# Altium schematic sheet AFE.SchDoc
size B; Organization: Altium Limited; Address1: L3, 12a Rodborough Rd; Address2: Frenchs Forest; Address3: NSW; Address4: Australia 2086
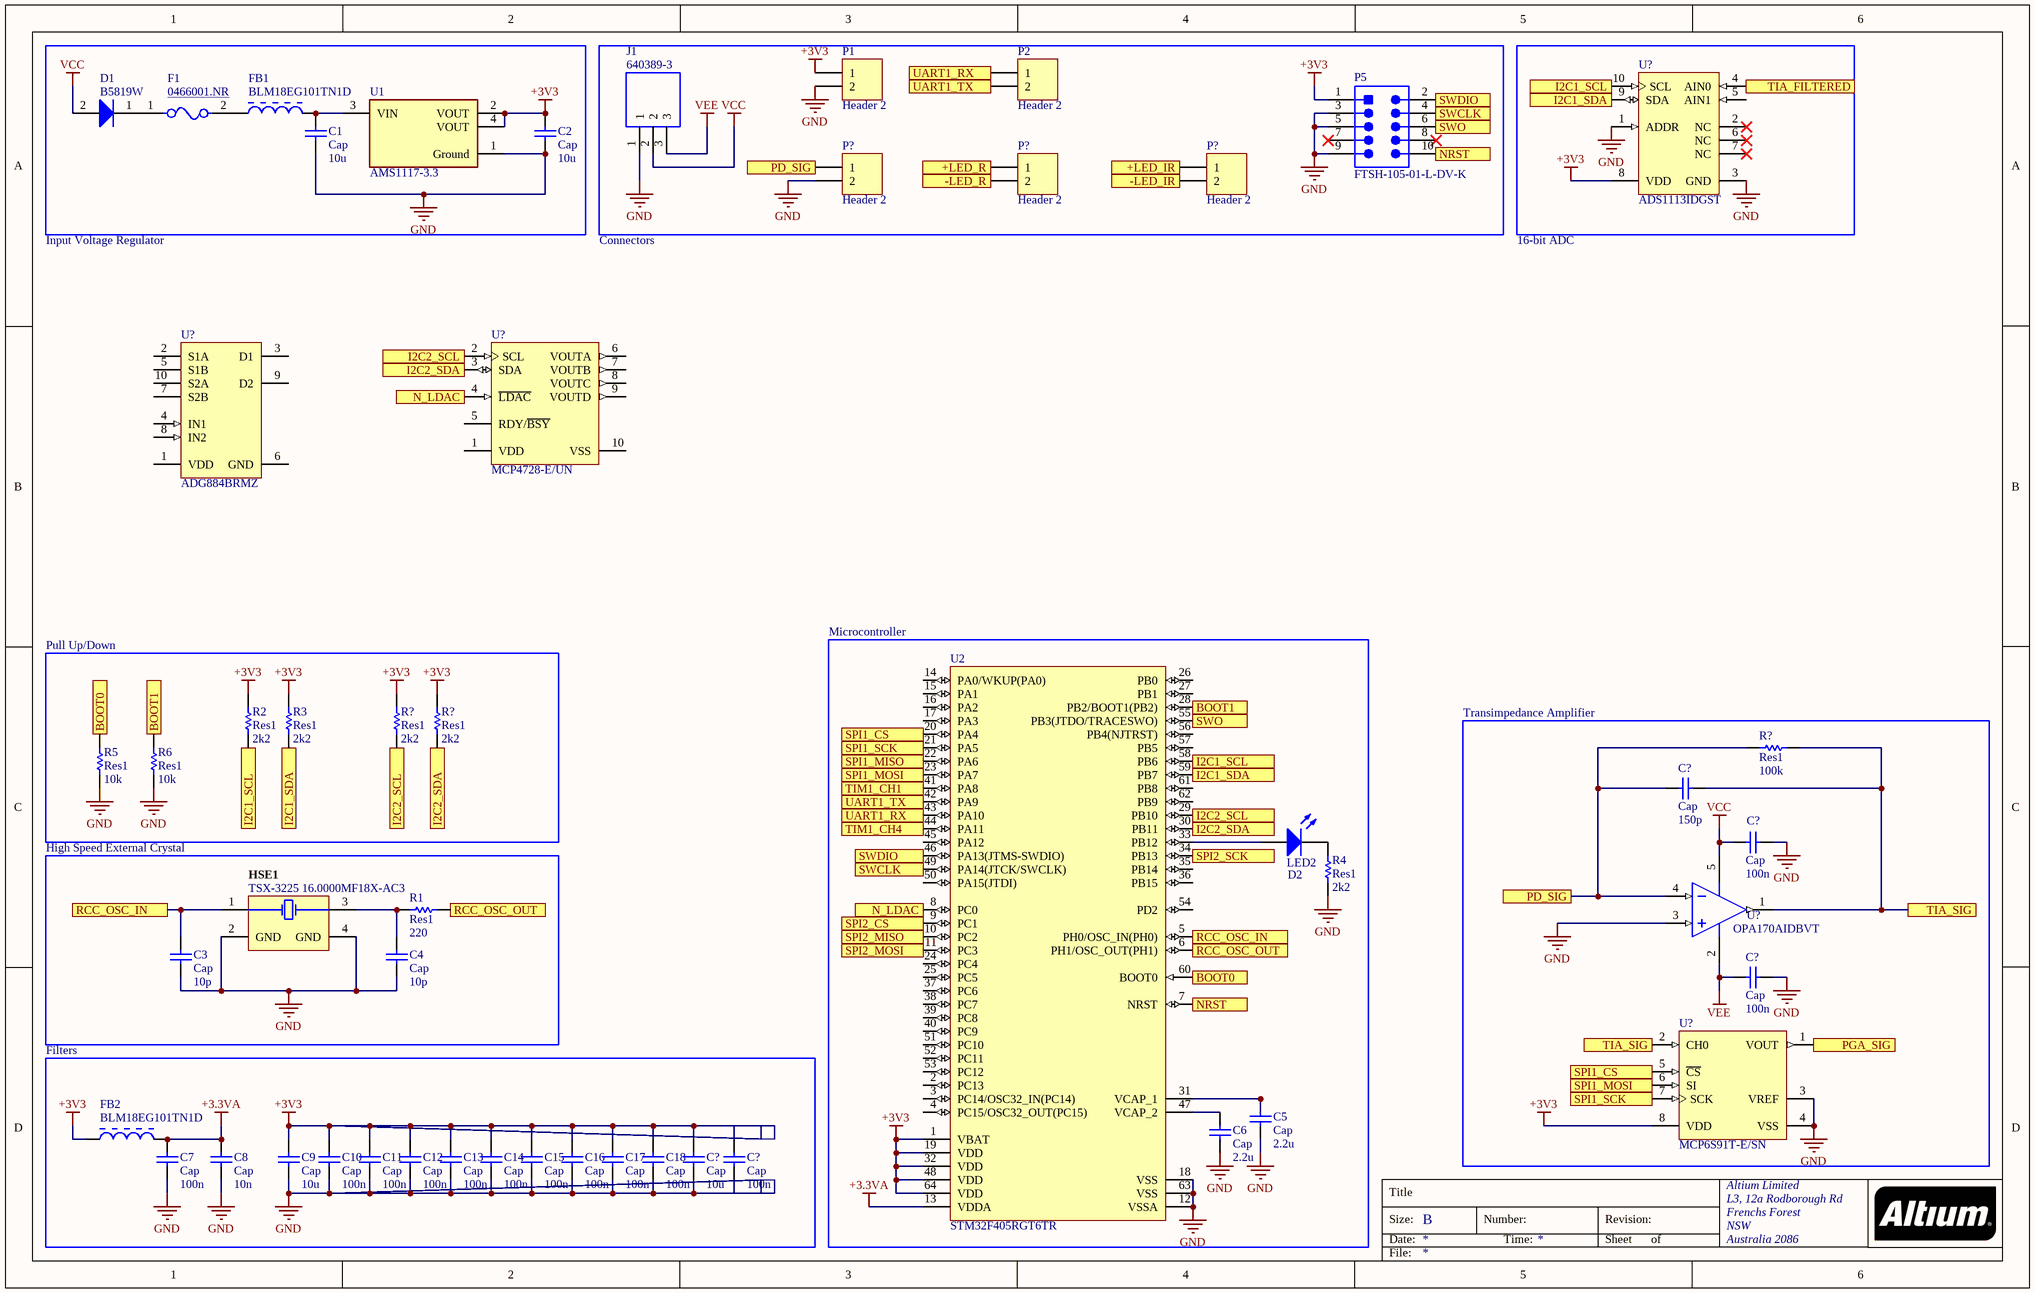
[diagram p0: AFE.SchDoc]

## Parts
(Parts that share a designator on the sheet are numbered #1, #2 ... from top to bottom, then left to right.)
C1  Cap  value 10u  [RAD-0.3]
C2  Cap  value 10u  [RAD-0.3]
C3  Cap  value 10p  [RAD-0.3]
C4  Cap  value 10p  [RAD-0.3]
C5  Cap  value 2.2u  [RAD-0.3]
C6  Cap  value 2.2u  [RAD-0.3]
C7  Cap  value 100n  [RAD-0.3]
C8  Cap  value 10n  [RAD-0.3]
C9  Cap  value 10u  [RAD-0.3]
C10  Cap  value 100n  [RAD-0.3]
C11  Cap  value 100n  [RAD-0.3]
C12  Cap  value 100n  [RAD-0.3]
C13  Cap  value 100n  [RAD-0.3]
C14  Cap  value 100n  [RAD-0.3]
C15  Cap  value 100n  [RAD-0.3]
C16  Cap  value 100n  [RAD-0.3]
C17  Cap  value 100n  [RAD-0.3]
C18  Cap  value 100n  [RAD-0.3]
C?#1  Cap  value 150p  [RAD-0.3]
C?#2  Cap  value 100n  [RAD-0.3]
C?#3  Cap  value 100n  [RAD-0.3]
C?#4  Cap  value 10u  [RAD-0.3]
C?#5  Cap  value 100n  [RAD-0.3]
D1  B5819W  [ONSC-SOD-323-2-477-02_V]
D2  LED2  [3.2X1.6X1.1]
F1  0466001.NR  [FP-0466-MFG]
FB1  BLM18EG101TN1D  [MURA-BLM18-RF-H3-CHIP-2_V]
FB2  BLM18EG101TN1D  [MURA-BLM18-RF-H3-CHIP-2_V]
HSE1  TSX-3225 16.0000MF18X-AC3  [EPSON-TSX-3225_V]
J1  640389-3  [640389-3]
P1  Header 2  [HDR1X2]
P2  Header 2  [HDR1X2]
P5  FTSH-105-01-L-DV-K  [SMTC-FTSH-105-01-L-DV-K_V]
P?#1  Header 2  [HDR1X2]
P?#2  Header 2  [HDR1X2]
P?#3  Header 2  [HDR1X2]
R1  Res1  value 220  [AXIAL-0.3]
R2  Res1  value 2k2  [AXIAL-0.3]
R3  Res1  value 2k2  [AXIAL-0.3]
R4  Res1  value 2k2  [AXIAL-0.3]
R5  Res1  value 10k  [AXIAL-0.3]
R6  Res1  value 10k  [AXIAL-0.3]
R?#1  Res1  value 2k2  [AXIAL-0.3]
R?#2  Res1  value 2k2  [AXIAL-0.3]
R?#3  Res1  value 100k  [AXIAL-0.3]
U1  AMS1117-3.3  [FP-AMS1117-IPC_C]
U2  STM32F405RGT6TR  [STM-LQFP64_L]
U?#1  ADS1113IDGST  [TI-DGS10_L]
U?#2  ADG884BRMZ  [ADI-RM-10_L]
U?#3  MCP4728-E/UN  [MSOP-UN10_N]
U?#4  OPA170AIDBVT  [DBV0005A_L]
U?#5  MCP6S91T-E/SN  [SOIC-SN8_N]

## Blocks framed on the sheet
Pull Up/Down: R2 R3 R5 R6 R?#1 R?#2
Microcontroller: C5 C6 D2 R4 U2
Transimpedance Amplifier: C?#1-C?#3 R?#3 U?#4 U?#5
High Speed External Crystal: C3 C4 HSE1 R1
Filters: C7-C18 C?#4 C?#5 FB2

## Ports
+LED_IR, +LED_R, -LED_IR, -LED_R, BOOT0, BOOT1, I2C1_SCL, I2C1_SDA, I2C2_SCL, I2C2_SDA, N_LDAC, NRST, PD_SIG, PGA_SIG, RCC_OSC_IN, RCC_OSC_OUT, SPI1_CS, SPI1_MISO, SPI1_MOSI, SPI1_SCK, SPI2_CS, SPI2_MISO, SPI2_MOSI, SPI2_SCK, SWCLK, SWDIO, SWO, TIA_FILTERED, TIA_SIG, TIM1_CH1, TIM1_CH4, UART1_RX, UART1_TX

## Nets
+3.3VA: C7.2 C8.2 FB2.2 U2.13(VDDA)
+3V3: C2.2 C9.2 C10.2 C11.2 C12.2 C13.2 C14.2 C15.2 C16.2 C17.2 C18.2 C?#4.2 C?#5.2 FB2.1 P1.1 P5.1 R2.2 R3.2 R?#1.2 R?#2.2 U1.2(VOUT) U1.4(VOUT) U2.1(VBAT) U2.19(VDD) U2.32(VDD) U2.48(VDD) U2.64(VDD) U?#1.8(VDD) U?#5.8(VDD)
GND: C1.1 C2.1 C3.1 C4.1 C5.1 C6.1 C7.1 C8.1 C9.1 C10.1 C11.1 C12.1 C13.1 C14.1 C15.1 C16.1 C17.1 C18.1 C?#2.1 C?#3.1 C?#4.1 C?#5.1 HSE1.2(GND) HSE1.4(GND) J1.1 P1.2 P5.3 P5.5 P5.9 P?#1.2 R4.1 R5.1 R6.1 U1.1(Ground) U2.12(VSSA) U2.18(VSS) U2.63(VSS) U?#1.1(ADDR) U?#1.3(GND) U?#4.3(IN+) U?#5.3(VREF) U?#5.4(VSS)
VCC: C?#2.2 D1.2(A) J1.2 U?#4.5(V+)
VEE: C?#3.2 J1.3 U?#4.2(V-)
+LED_IR: P?#3.1 ; port +LED_IR
+LED_R: P?#2.1 ; port +LED_R
-LED_IR: P?#3.2 ; port -LED_IR
-LED_R: P?#2.2 ; port -LED_R
BOOT0: R5.2 U2.60(BOOT0) ; port BOOT0
BOOT1: R6.2 U2.28(PB2/BOOT1(PB2)) ; port BOOT1
I2C1_SCL: R2.1 U2.58(PB6) U?#1.10(SCL) ; port I2C1_SCL
I2C1_SDA: R3.1 U2.59(PB7) U?#1.9(SDA) ; port I2C1_SDA
I2C2_SCL: R?#1.1 U2.29(PB10) U?#3.2(SCL) ; port I2C2_SCL
I2C2_SDA: R?#2.1 U2.30(PB11) U?#3.3(SDA) ; port I2C2_SDA
N_LDAC: U2.8(PC0) U?#3.4(~{LDAC}) ; port N_LDAC
NRST: P5.10 U2.7(NRST) ; port NRST
PD_SIG: C?#1.2 P?#1.1 R?#3.2 U?#4.4(IN-) ; port PD_SIG
PGA_SIG: U?#5.1(VOUT) ; port PGA_SIG
RCC_OSC_IN: C3.2 HSE1.1(X1) U2.5(PH0/OSC_IN(PH0)) ; port RCC_OSC_IN
RCC_OSC_OUT: R1.2 U2.6(PH1/OSC_OUT(PH1)) ; port RCC_OSC_OUT
SPI1_CS: U2.20(PA4) U?#5.5(~{CS}) ; port SPI1_CS
SPI1_MISO: U2.22(PA6) ; port SPI1_MISO
SPI1_MOSI: U2.23(PA7) U?#5.6(SI) ; port SPI1_MOSI
SPI1_SCK: U2.21(PA5) U?#5.7(SCK) ; port SPI1_SCK
SPI2_CS: U2.9(PC1) ; port SPI2_CS
SPI2_MISO: U2.10(PC2) ; port SPI2_MISO
SPI2_MOSI: U2.11(PC3) ; port SPI2_MOSI
SPI2_SCK: U2.34(PB13) ; port SPI2_SCK
SWCLK: P5.4 U2.49(PA14(JTCK/SWCLK)) ; port SWCLK
SWDIO: P5.2 U2.46(PA13(JTMS-SWDIO)) ; port SWDIO
SWO: P5.6 U2.55(PB3(JTDO/TRACESWO)) ; port SWO
TIA_FILTERED: U?#1.4(AIN0) ; port TIA_FILTERED
TIA_SIG: C?#1.1 R?#3.1 U?#4.1(OUT) U?#5.2(CH0) ; port TIA_SIG
TIM1_CH1: U2.41(PA8) ; port TIM1_CH1
TIM1_CH4: U2.44(PA11) ; port TIM1_CH4
UART1_RX: P2.1 U2.43(PA10) ; port UART1_RX
UART1_TX: P2.2 U2.42(PA9) ; port UART1_TX
NetC1_2: C1.2 FB1.2 U1.3(VIN)
NetC4_2: C4.2 HSE1.3(X2) R1.1
NetC5_2: C5.2 U2.31(VCAP_1)
NetC6_2: C6.2 U2.47(VCAP_2)
NetD1_1: D1.1(K) F1.1
NetD2_1: D2.1(A) U2.33(PB12)
NetD2_2: D2.2(K) R4.2
NetF1_2: F1.2 FB1.1

Not connected (* = marked no-connect by the designer): P5 7* 8*; U2 2(PC13) 3(PC14/OSC32_IN(PC14)) 4(PC15/OSC32_OUT(PC15)) 14(PA0/WKUP(PA0)) 15(PA1) 16(PA2) 17(PA3) 24(PC4) 25(PC5) 26(PB0) 27(PB1) 35(PB14) 36(PB15) 37(PC6) 38(PC7) 39(PC8) 40(PC9) 45(PA12) 50(PA15(JTDI)) 51(PC10) 52(PC11) 53(PC12) 54(PD2) 56(PB4(NJTRST)) 57(PB5) 61(PB8) 62(PB9); U?#1 2(NC)* 5(AIN1) 6(NC)* 7(NC)*; U?#2 1(VDD) 2(S1A) 3(D1) 4(IN1) 5(S1B) 6(GND) 7(S2B) 8(IN2) 9(D2) 10(S2A); U?#3 1(VDD) 5(RDY/~{BSY}) 6(VOUTA) 7(VOUTB) 8(VOUTC) 9(VOUTD) 10(VSS)

## Notes on the sheet
- Input Voltage Regulator
- Connectors
- 16-bit ADC
- Title
- Size:
- Date:
- B
- Number:
- Time:
- Revision:
- Sheet
- of
- File:

## Library data of the parts
C1-C18 C?#1-C?#5 = Cap: Capacitor; Published: 8-Jun-2000; LatestRevisionDate: 17-Jul-2002; LatestRevisionNote: Re-released for DXP Platform.; PackageReference: RAD-0.3; Publisher: Altium Limited; PackageDescription: Radial Cap, Thru-Hole; 2 Leads; 0.3 in Pin Spacing
D1 = CMP-1055-00462-1: Schottky Barrier Diode, 2-Pin SOD-323, Pb-Free, Tape and Reel; PartNumber: BAT54HT1G; Manufacturer: On Semiconductor; Configuration: Single; trr Max (ns): 5; IFSM Max (A): 0.6; ComponentLink3URL: http://www.onsemi.com/pub_link/Collateral/477-02.PDF.1; PackageDescription: 2-Pin SOD, Body 1.7 x 1.25 mm; ComponentLink2URL: http://www.onsemi.cn/pub_link/Collateral/BAT54HT1-D.PDF; ComponentLink3Description: Package Specification; ComponentLink2Description: Datasheet; DatasheetVersion: Rev. 6; PackageReference: SOD-323-2-477-02; RoHS: TRUE; ComponentLink1URL: http://www.onsemi.com/; Packing: Tape and Reel; Mounting Technology: Surface Mount; ComponentLink1Description: Manufacturer URL; PackageVersion: Rev. H, 03/2007
D2 = LED2: Typical RED, GREEN, YELLOW, AMBER GaAs LED; Published: 8-Jun-2000; LatestRevisionDate: 17-Jul-2002; LatestRevisionNote: Re-released for DXP Platform.; PackageVersion: Feb-2002; PackageReference: 3.2X1.6X1.1; Publisher: Altium Limited; PackageDescription: SM LED; 2 Flat Leads
F1 = CMP-08605-000058-1: FUSE BOARD MNT 1A 63VAC/VDC 1206; Manufacturer: Littelfuse Inc; Max Fuse Dc Voltage: 63V; Fuse Interrupt Ac Current: 50A; Fuse Voltage Drop: 79.97mV; Resistance: 0.075Ω; Value: 0.075Ω; Fuse I2T: 0.0423A2Sec; Fuse Blow Speed: Fast; Temperature Range High: +90°C; Max Fuse Ac Voltage: 63V; Manufacturer Part Number: 0466001.NR; Package: 0466; ComponentLink2URL: https://www.littelfuse.com/~/media/electronics/datasheets/fuses/littelfuse_fuse_466_datasheet.pdf.pdf; Device Class L3: unset; Lead Free: Yes; Automotive: No; Digikey Description: FUSE BOARD MNT 1A 63VAC/VDC 1206; Height: 0.66mm; Temperature Range Low: -55°C; Category: Fuse; ComponentLink2Description: Datasheet; Device Class L1: Circuit Protection; Device Class L2: Fuses; Fuse Current: 1A; Mouser Description: Surface Mount Fuses 63V FA 1206 1A VFA Slimline; Octopart: https://octopart.com/0466001.nr-littelfuse-566005; Fuse Interrupt Dc Current: 50A; RoHS: TRUE; Voltage Rating: 63V; Temperature: -55°C to +90°C
FB1 FB2 = CMP-0686-00530-2: Chip Ferrite Bead for GHz Band General Use (Low DC Resistance Type), 100 Ohm, 2000 mA, -55 to 125 degC, 1.6 x 0.8 x 0.65 mm SMD, Tape and Reel; Manufacturer: Murata; Rated Current: 2000 mA; Impedance (at 100 MHz): 100 Ohm +/- 25%; DC Resistance: 0.045 Ohm Max.; ComponentLink3Description: Package Specification; ComponentLink2URL: http://www.murata.com/products/catalog/pdf/c31e.pdf; DatasheetVersion: 08/2013; ComponentLink1Description: Manufacturer URL; Packing: Tape and Reel; PackageDescription: 2-Pin Chip, Body 1.6 x 0.8 mm; Operating Temperature Range: -55 to 125 degC; ComponentLink1URL: http://www.murata.com/; ComponentLink2Description: Datasheet; Mounting Technology: Surface Mount; PartNumber: BLM18EG101TN1D; ComponentLink3URL: http://www.murata.com/products/catalog/pdf/c31e.pdf; PackageReference: BLM18_H650-2
HSE1 = CMP-2000-07332-1: MHz Range Crystal Unit, 16 MHz, -40 to 85 degC, 4-Pin SMD, RoHS, Tape and Reel; Manufacturer: Epson; Unit Weight: 0.000564oz; Tolerance: 10PPM; ESR: 60Ohms; Frequency: 16MHz; Drive Level: 200uW; Brand: EpsonTiming; Load Capacitance: 9pF; Product Category: Crystals; Packaging: Reel; Termination Style: SMD/SMT; Width: 2.5mm; Length: 3.2mm; Type: Crystal; Datasheet Version: 12/2015; Factory Pack Quantity: 250; Package Description: 4-Pin Surface Mount Device, Body 3.2 x 2.5 mm; Package / Case: 3.2mmx2.5mm; Mounting Style: SMD/SMT; Series: TSX-3225; Frequency Stability: 10PPM; Package Reference: TSX-3225; Mounting Technology: SurfaceMount; RoHS: True; Height: 0.6mm; Datasheet URL: https://support.epson.biz/td/api/doc_check.php?dl=brief_FA-238V_en.pdf; Operating Temperature Range: -40Cto+85C; Manufacturer URL: https://www.eea.epson.com/
J1 = 640389-3: 3 way r/a friction lock header,3.96mm TE Connectivity MTA-156 Series, 3.96mm Pitch 3 Way 1 Row Right Angle PCB Header, Solder Termination, 7A; Allied_Number: 70083704; Manufacturer_Name: TE Connectivity; Manufacturer_Part_Number: 640389-3; Mouser Part Number: 571-6403893; Mouser Price/Stock: https://www.mouser.com/Search/Refine.aspx?Keyword=571-6403893; RS Part Number: 5355894P; RS Price/Stock: http://uk.rs-online.com/web/p/products/5355894P; Allied Price/Stock: http://www.alliedelec.com/te-connectivity-640389-3/70083704/; Datasheet Link: http://docs-emea.rs-online.com/webdocs/06b6/0900766b806b63a3.pdf
P1 P2 P?#1-P?#3 = Header 2: Header, 2-Pin; LatestRevisionDate: 17-Jul-2002; LatestRevisionNote: Re-released for DXP Platform.; Publisher: Altium Limited
P5 = CMP-2000-05353-1: Male Header, Pitch 1.27 mm, 2 x 5 Position, Height 6.25 mm; Manufacturer: Samtec; Pitch: 0.050"(1.27mm); Other Names: Q3937619; Number of Positions: 10; Mating Products: SFMC-105-L2-S-D-TR-ND / -CONN.05"SURFACE10POSSMT / FLE-105-01-G-DV-TR-ND / -CONNSKT1.27MM10POSDUALSMD / FLE-105-01-G-DV-A-P-ND / -CONNSKT1.27MM10POSDUALSMD / FLE-105-01-G-DV-A-ND / -CONNSKT1.27MM10POSDUALSMD / CLP-105-02-G-D-P-TR-ND / -CONNRCPT10POSDUAL.05"SMD / SAM1155-05-ND / -CONNRCPT10POSDUAL.05"SMD / SAM1154-05-ND / -CONNRCPT10POSDUAL.05"SMD / SAM1153-05-ND / -CONNRCPT10POSDUAL.05"SMD / SAM1226-05-ND / -CONNRCPT.05"10POSDUALSMD; Number of Positions Loaded: All; Connector Type: Header,Unshrouded; Product Training Modules: Board-to-BoardConnectors; Datasheet Version: Rev. ET, 10/1995; Number of Rows: 2; Standard Package: 1; Package Description: Male Header, Pitch 1.27 mm, 2 x 5 Position, Height 5.97 mm, Tail Length 4.32 mm; Contact Finish Thickness: 10µin(0.25µm); Series: FTSH; Termination: Solder; Contact Type: MalePin; Color: Black; Package Reference: FTSH-105-01-L-DV-K; Family: RectangularConnectors-Headers,MalePins; Package URL: http://suddendocs.samtec.com/prints/ftsh-1xx-xx-xxx-dv-xxx-footprint.pdf; Packaging: Tube; Mounting Type: SurfaceMount; Category: Connectors,Interconnects; Datasheet URL: http://suddendocs.samtec.com/prints/ftsh-1xx-xx-xxx-dv-xxx-mkt.pdf; Row Spacing: 0.050"(1.27mm); Manufacturer URL: http://www.samtec.com/; Contact Mating Length: 0.120"(3.05mm); Contact Finish: Gold
R1-R6 R?#1-R?#3 = Res1: Resistor; Published: 8-Jun-2000; LatestRevisionDate: 17-Jul-2002; LatestRevisionNote: Re-released for DXP Platform.; PackageReference: AXIAL-0.3; Publisher: Altium Limited; PackageDescription: Axial Device, Thru-Hole; 2 Leads; 0.3 in Pin Spacing
U1 = CMP-209535-000001-1: LDO Voltage Regulators 1A, 3.3V; Manufacturer: Advanced Monolithic Systems; Dropout Voltage: 1.1V; Output Type: Fixed; Nominal Supply Current: 5mA; Max Power Dissipation: 1.2W; Max Supply Voltage: 15V; Number Of Outputs: 1; Standoff Height: 0.64mm; Max Junction Temp: +125°C; Height: 1.8mm; Package: AMS1117; Device Class L2: Power Management ICs; ComponentLink2Description: Datasheet; ComponentLink2URL: http://www.advanced-monolithic.com/pdf/ds1117.pdf; Category: IC; RoHS: TRUE; Automotive: No; Device Class L1: Integrated Circuits (ICs); Output Current: 1A; Device Class L3: Voltage Regulators - Linear; Temperature: -40°C to +125°C; Output Voltage: 3.3V; Manufacturer Part Number: AMS1117-3.3; Temperature Range Low: -40°C; Octopart: https://octopart.com/ams1117-3.3-advanced+monolithic+systems-25899300; Lead Free: Yes; Ipc Land Pattern Name: SOT229P700X180-4; Temperature Range High: +125°C
U2 = CMP-0243-00156-1: ARM Cortex-M4 32-bit MCU+FPU, 1024 KB Flash, 192 KB Internal RAM, 51 I/Os, 64-Pin LQFP, -40 to 85 degC, Tape and Reel; Internal RAM Size (kB): 192; FLASH Size (Prog) (kB): 1024; Supply Voltage(Vcc) min (V): 1.8; D/A Converter: 2; Operating Frequency(F) (Processor speed) (MHz): 168; I/Os (High Current): 51; DatasheetVersion: Rev. 6; Package Description: LQFP64; ComponentLink2Description: Datasheet; ComponentLink1Description: Manufacturer URL; Packing: Tape and Reel; Mounting Technology: Surface Mount; Package Reference: 64-Pin Low-profile Quad Flat Package, Body 10 x 10 mm, Pitch 0.5 mm; ComponentLink2URL: http://www.st.com/st-web-ui/static/active/en/resource/technical/document/datasheet/DM00037051.pdf; ComponentLink1URL: http://www.st.com/; Core: ARM Cortex-M4
U?#1 = CMP-0003-00386-2: 16-Bit ADC with Integrated Multiplexer, Oscillator, and Reference, -40 to 125 degC, 10-pin SOP (DGS10), Green (RoHS & no Sb/Br); Manufacturer: Texas Instruments; Resolution(Bits): 16; INL(Max)(+/-LSB): 1; Interface: Serial I2C; Analog Voltage AV/DD(Max)(V): 5.5; Analog Voltage AV/DD(Min)(V): 2; SubFamily: Precision ADC (<=10MSPS); Architecture: Delta-Sigma; Sample Rate (max)(SPS): 860; ComponentLink2URL: http://www.ti.com/general/docs/lit/getliterature.tsp?genericPartNumber=ADS1113&fileType=pdf; Mounting Technology: Surface Mount; ComponentLink3Description: Package Specification; PartNumber: ADS1113IDGST; PackageDescription: 10-Pin Plastic Small Outline, Body 3 x 3 mm, Pitch 0.5 mm; ComponentLink1URL: http://www.ti.com/; PackageReference: DGS10; Eco-Plan: Green (RoHS & no Sb/Br); ComponentLink3URL: http://www.ti.com/lit/ml/mpds035b/mpds035b.pdf; PackageVersion: 4073272/C, 02/2004; Code_JEDEC: MO-153; ComponentLink2Description: Datasheet; # Input Channels: 1; ComponentLink1Description: Manufacturer URL; Digital Supply(Min)(V): 2; DatasheetVersion: SBAS444B; Digital Supply(Max)(V): 5.5
U?#2 = CMP-0790-00116-1: 0.5 Ohm CMOS, Dual 2:1 MUX / SPDT Audio Switches, -40 to 85 degC, 10-pin SOP (RM-10), Tube; Manufacturer: Analog Devices; Max Pos Supply: 5.5V; Is OFF: 200pA, 200pA, 200pA; Min Pos Supply: 1.8V; Ron (ohms): 0.5; Power Dissipation: 5.5uW; # Sw Functions: 2; ComponentLink2URL: http://www.analog.com/static/imported-files/data_sheets/ADG884.pdf; Packing: Tube; PackageDescription: 10-Pin Mini Small Outline Package, Body 3 x 3 mm, Pitch 0.5 mm; ComponentLink3URL: http://www.analog.com/static/imported-files/packages/PKG_PDF/MSOP%28RM%29/RM_10.pdf; ComponentLink3Description: Package Specification; PackageVersion: Aug-05; DatasheetVersion: Rev. D; PartNumber: ADG884BRMZ; Configuration: SPDT; Id, Is (ON): 200pA, 200pA, 200pA; ComponentLink2Description: Datasheet; ComponentLink1URL: http://www.analog.com/en/index.html; Code_JEDEC: MO-187-BA; Mounting Technology: Surface Mount; ComponentLink1Description: Manufacturer URL; PackageReference: RM-10
U?#3 = CMP-0188-01008-2: 12-Bit Quad Digital-to-Analog Converter with EEPROM Memory, 10-pin MSOP, Extended Temperature; ComponentLink2URL: http://ww1.microchip.com/downloads/en/DeviceDoc/22187E.pdf; ComponentLink3Description: Package Specification; PackageReference: MSOP-UN10; ComponentLink3URL: http://www.microchip.com/stellent/groups/techpub_sg/documents/packagingspec/en012702.pdf; ComponentLink2Description: Datasheet; PackageDescription: 10-Lead Plastic Micro Small Outline Package (UN) [MSOP]; DatasheetVersion: revE, Oct-2010; RevisionNote: URLs added. DatasheetVersion updated.; PackageVersion: revBB, Aug-2009; ComponentLink1Description: Manufacturer URL; ComponentLink1URL: http://www.microchip.com/
U?#4 = CMP-0272-00932-3: MicroPower, Rail-to-Rail Output, General Purpose Operational Amplifier, 2.7 to 36 V, -40 to 125 degC, 5-pin SOT23 (DBV5), Green (RoHS & no Sb/Br); Manufacturer: Texas Instruments; Total Supply Voltage(Min)(+5V is 5, +/-5V is 10): 2.7; Rating: Catalog; Vio (25C)(Max)(mV): 1.8; Packing: SMALL T&R; GBW(Typ)(MHz): 1.2; Sub Family: High Supply Voltage Amplifier (>=30V), Low Power Amp (<=500uA), Low Supply Voltage Amplifier (<=2.7V), Precision Amplifier; CMRR(Min)(dB): 104; Iq per channel(Max)(mA): 0.145; Number of Channels: 1; IIB(Max)(pA): 15; Offset Drift(Typ)(uV/C): 0.3; Total Supply Voltage(Max)(+5V is 5, +/-5V is 10): 36; Slew Rate(Typ)(V/us): 0.4; ComponentLink2Description: Datasheet; PackageReference: DBV0005A; ComponentLink1URL: http://www.ti.com/; DatasheetVersion: SBOS557B; ComponentLink1Description: Manufacturer URL; Mounting Technology: Surface Mount; ComponentLink3Description: Package Specification; ComponentLink3URL: http://www.ti.com/litv/pdf/mpds018i; PackageDescription: 5-Pin Plastic Small Outline, Body 1.6 x 2.9 mm, Pitch 0.95 mm; Eco-Plan: Green (RoHS & no Sb/Br); PackageVersion: 4073253-4/K, 03/2006; PartNumber: OPA170AIDBVT; ComponentLink2URL: http://www.ti.com/lit/ds/symlink/opa170.pdf; Code_JEDEC: MO-178
U?#5 = CMP-0187-00272-2: Single-Ended, Rail-to-Rail Input/Output, Low-Gain Programmable Gain Amplifier, 8-Pin SOIC, Extended Temperature, Tape and Reel; Code_JEDEC: MS-012; ComponentLink1Description: Manufacturer URL; ComponentLink2Description: Datasheet; DatasheetVersion: revA, Oct-2004; ComponentLink3URL: http://www.microchip.com/stellent/groups/techpub_sg/documents/packagingspec/en012702.pdf; PackageVersion: revBB, Aug-2009; RevisionNote: URLs added.; ComponentLink2URL: http://ww1.microchip.com/downloads/en/DeviceDoc/21908a.pdf; PackageDescription: 8-Lead Plastic Small Outline (SN) - Narrow, 3.90mm Body [SOIC]; ComponentLink1URL: http://www.microchip.com/; PackageReference: SOIC-SN8; ComponentLink3Description: Package Specification; Code_IPC: SOIC127P600-8